# Altium schematic sheet S3_Arduino.SchDoc
size A4
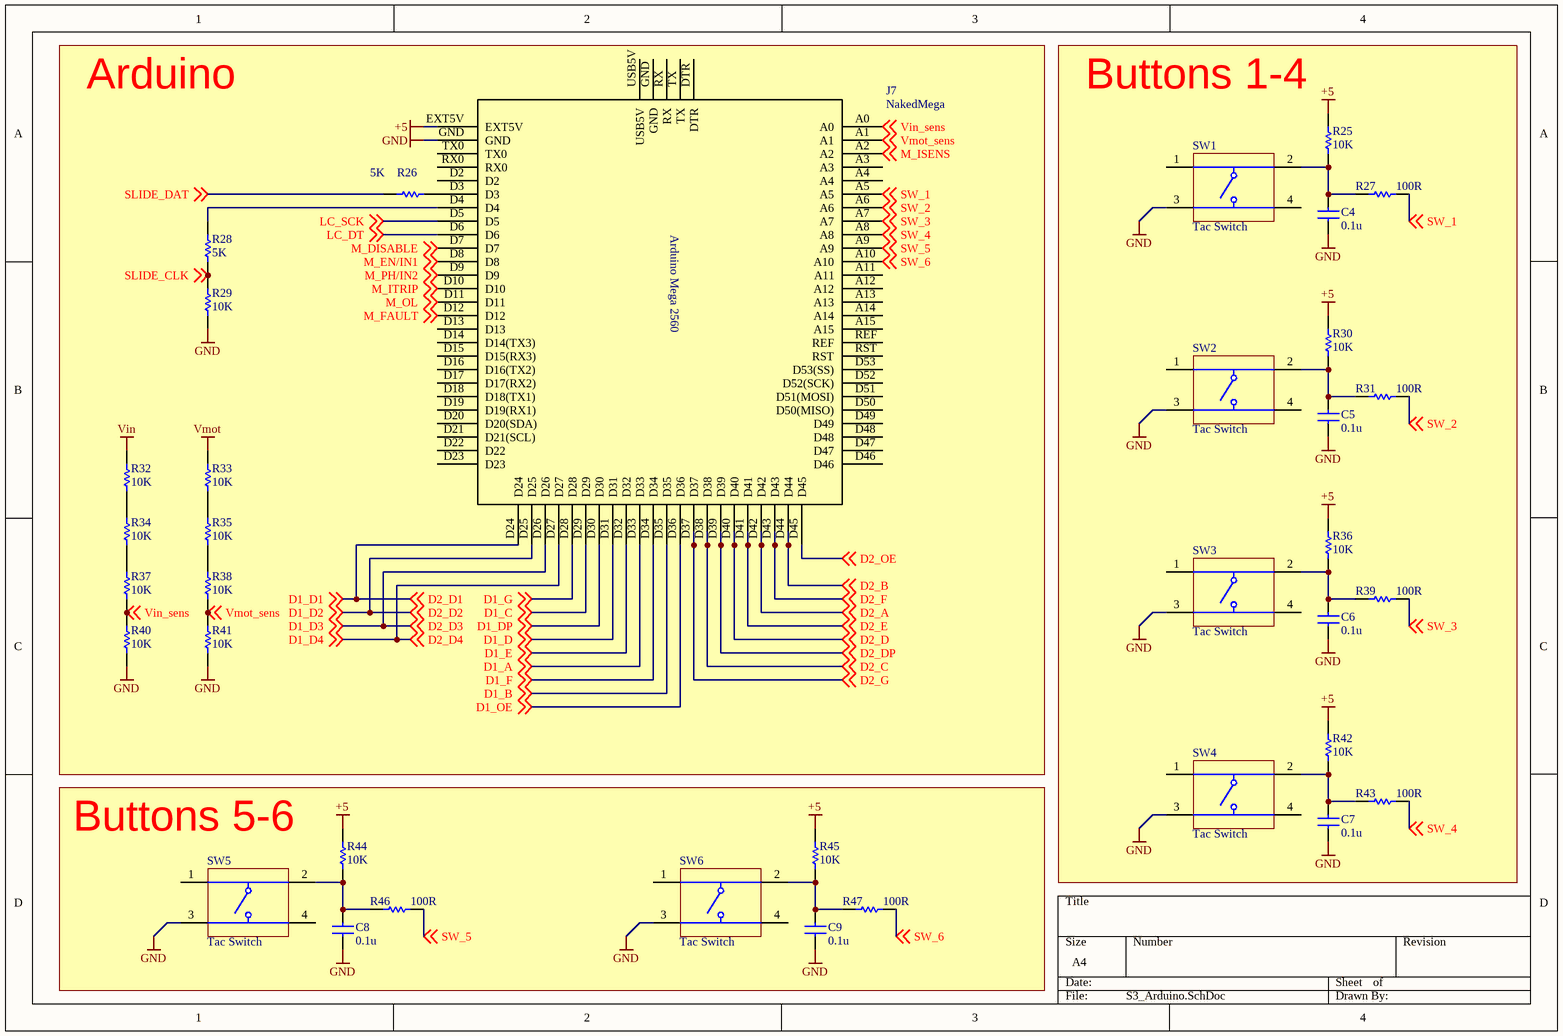
[diagram p0: S3_Arduino.SchDoc]

## Parts
C4  0.1u  [Ceramic Cap 5mm]
C5  0.1u  [Ceramic Cap 5mm]
C6  0.1u  [Ceramic Cap 5mm]
C7  0.1u  [Ceramic Cap 5mm]
C8  0.1u  [Ceramic Cap 5mm]
C9  0.1u  [Ceramic Cap 5mm]
J7  NakedMega  [Arduino Mega]
R25  value 10K  [AXIAL-0.3-3D]  (hidden comment: Res1)
R26  value 5K  [AXIAL-0.3-3D]  (hidden comment: Res1)
R27  value 100R  [AXIAL-0.3-3D]  (hidden comment: Res1)
R28  value 5K  [AXIAL-0.3-3D]  (hidden comment: Res1)
R29  value 10K  [AXIAL-0.3-3D]  (hidden comment: Res1)
R30  value 10K  [AXIAL-0.3-3D]  (hidden comment: Res1)
R31  value 100R  [AXIAL-0.3-3D]  (hidden comment: Res1)
R32  value 10K  [AXIAL-0.3-3D]  (hidden comment: Res1)
R33  value 10K  [AXIAL-0.3-3D]  (hidden comment: Res1)
R34  value 10K  [AXIAL-0.3-3D]  (hidden comment: Res1)
R35  value 10K  [AXIAL-0.3-3D]  (hidden comment: Res1)
R36  value 10K  [AXIAL-0.3-3D]  (hidden comment: Res1)
R37  value 10K  [AXIAL-0.3-3D]  (hidden comment: Res1)
R38  value 10K  [AXIAL-0.3-3D]  (hidden comment: Res1)
R39  value 100R  [AXIAL-0.3-3D]  (hidden comment: Res1)
R40  value 10K  [AXIAL-0.3-3D]  (hidden comment: Res1)
R41  value 10K  [AXIAL-0.3-3D]  (hidden comment: Res1)
R42  value 10K  [AXIAL-0.3-3D]  (hidden comment: Res1)
R43  value 100R  [AXIAL-0.3-3D]  (hidden comment: Res1)
R44  value 10K  [AXIAL-0.3-3D]  (hidden comment: Res1)
R45  value 10K  [AXIAL-0.3-3D]  (hidden comment: Res1)
R46  value 100R  [AXIAL-0.3-3D]  (hidden comment: Res1)
R47  value 100R  [AXIAL-0.3-3D]  (hidden comment: Res1)
SW1  Tac Switch  [TacSwitch]
SW2  Tac Switch  [TacSwitch]
SW3  Tac Switch  [TacSwitch]
SW4  Tac Switch  [TacSwitch]
SW5  Tac Switch  [TacSwitch]
SW6  Tac Switch  [TacSwitch]

## Blocks framed on the sheet
Arduino: J7 R26 R28 R29 R32-R35 R37 R38 R40 R41
Buttons 1-4: C4-C7 R25 R27 R30 R31 R36 R39 R42 R43 SW1-SW4
Buttons 5-6: C8 C9 R44-R47 SW5 SW6

## Nets
+5: J7.EXT5V R25.1 R30.1 R36.1 R42.1 R44.1 R45.1
GND: C4.2 C5.2 C6.2 C7.2 C8.2 C9.2 J7.GND R29.2 R40.2 R41.2 SW1.3 SW2.3 SW3.3 SW4.3 SW5.3 SW6.3
Vin: R32.1
Vmot: R33.1
D1_A: J7.D33 ; off-sheet D1_A
D1_B: J7.D35 ; off-sheet D1_B
D1_C: J7.D29 ; off-sheet D1_C
D1_D: J7.D31 ; off-sheet D1_D
D1_D1: J7.D24 ; off-sheet D1_D1, off-sheet D2_D1  [also labelled D2_D1]
D1_D2: J7.D25 ; off-sheet D1_D2, off-sheet D2_D2  [also labelled D2_D2]
D1_D3: J7.D26 ; off-sheet D1_D3, off-sheet D2_D3  [also labelled D2_D3]
D1_D4: J7.D27 ; off-sheet D1_D4, off-sheet D2_D4  [also labelled D2_D4]
D1_DP: J7.D30 ; off-sheet D1_DP
D1_E: J7.D32 ; off-sheet D1_E
D1_F: J7.D34 ; off-sheet D1_F
D1_G: J7.D28 ; off-sheet D1_G
D1_OE: J7.D36 ; off-sheet D1_OE
D2_A: J7.D42 ; off-sheet D2_A
D2_B: J7.D44 ; off-sheet D2_B
D2_C: J7.D38 ; off-sheet D2_C
D2_D: J7.D40 ; off-sheet D2_D
D2_DP: J7.D39 ; off-sheet D2_DP
D2_E: J7.D41 ; off-sheet D2_E
D2_F: J7.D43 ; off-sheet D2_F
D2_G: J7.D37 ; off-sheet D2_G
D2_OE: J7.D45 ; off-sheet D2_OE
LC_DT: J7.D6 ; off-sheet LC_DT
LC_SCK: J7.D5 ; off-sheet LC_SCK
M_DISABLE: J7.D7 ; off-sheet M_DISABLE
M_EN/IN1: J7.D8 ; off-sheet M_EN/IN1
M_FAULT: J7.D12 ; off-sheet M_FAULT
M_ISENS: J7.A2 ; off-sheet M_ISENS
M_ITRIP: J7.D10 ; off-sheet M_ITRIP
M_OL: J7.D11 ; off-sheet M_OL
M_PH/IN2: J7.D9 ; off-sheet M_PH/IN2
SLIDE_CLK: R28.2 R29.1 ; off-sheet SLIDE_CLK
SLIDE_DAT: R26.1 ; off-sheet SLIDE_DAT
SW_1: J7.A5 R27.2 ; off-sheet SW_1
SW_2: J7.A6 R31.2 ; off-sheet SW_2
SW_3: J7.A7 R39.2 ; off-sheet SW_3
SW_4: J7.A8 R43.2 ; off-sheet SW_4
SW_5: J7.A9 R46.2 ; off-sheet SW_5
SW_6: J7.A10 R47.2 ; off-sheet SW_6
Vin_sens: J7.A0 R37.2 R40.1 ; off-sheet Vin_sens
Vmot_sens: J7.A1 R38.2 R41.1 ; off-sheet Vmot_sens
NetC4_1: C4.1 R25.2 R27.1 SW1.2
NetC5_1: C5.1 R30.2 R31.1 SW2.2
NetC6_1: C6.1 R36.2 R39.1 SW3.2
NetC7_1: C7.1 R42.2 R43.1 SW4.2
NetC8_1: C8.1 R44.2 R46.1 SW5.2
NetC9_1: C9.1 R45.2 R47.1 SW6.2
NetJ7_D3: J7.D3 R26.2
NetJ7_D4: J7.D4 R28.1
NetR32_2: R32.2 R34.1
NetR33_2: R33.2 R35.1
NetR34_2: R34.2 R37.1
NetR35_2: R35.2 R38.1

Not connected (* = marked no-connect by the designer): J7 A3 A4 A11 A12 A13 A14 A15 D2 D13 D14(D14(TX3)) D15(D15(RX3)) D16(D16(TX2)) D17(D17(RX2)) D18(D18(TX1)) D19(D19(RX1)) D20(D20(SDA)) D21(D21(SCL)) D22 D23 D46 D47 D48 D49 D50(D50(MISO)) D51(D51(MOSI)) D52(D52(SCK)) D53(D53(SS)) DTR REF RST RX RX0 TX TX0 USB5V; SW1 1 4; SW2 1 4; SW3 1 4; SW4 1 4; SW5 1 4; SW6 1 4

## Notes on the sheet
- (in symbol NakedMega) Arduino Mega 2560

## Library data of the parts
C4-C9 = Cap
J7 = NakedMega: pin to pad: D2>2 D3>3 D4>4 D5>5 D6>6 D7>7 D8>8 D9>9 D10>10 D11>11 D12>12 D13>13 D14>14 D15>15 D16>16 D17>17 D18>18 D19>19 D20>20 D21>21 D22>22 D23>23 D24>24 D25>25 D26>26 D27>27 D28>28 D29>29 D30>30 D31>31 D32>32 D33>33 D34>34 D35>35 D36>36 D37>37 D38>38 D39>39 D40>40 D41>41 D42>42 D43>43 D44>44 D45>45 D46>46 D47>47 D48>48 D49>49 D50>50 D51>51 D52>52 D53>53 DTR>none EXT5V>5V RX>none RX0>1 TX>none TX0>0 USB5V>none
R25-R47 = Res1: Resistor; Published: 8-Jun-2000; LatestRevisionDate: 17-Jul-2002; LatestRevisionNote: Re-released for DXP Platform.; PackageReference: AXIAL-0.3; Publisher: Altium Limited; PackageDescription: Axial Device, Thru-Hole; 2 Leads; 0.3 in Pin Spacing